# EAGLE schematic mod_io (EAGLE 7.5.0)
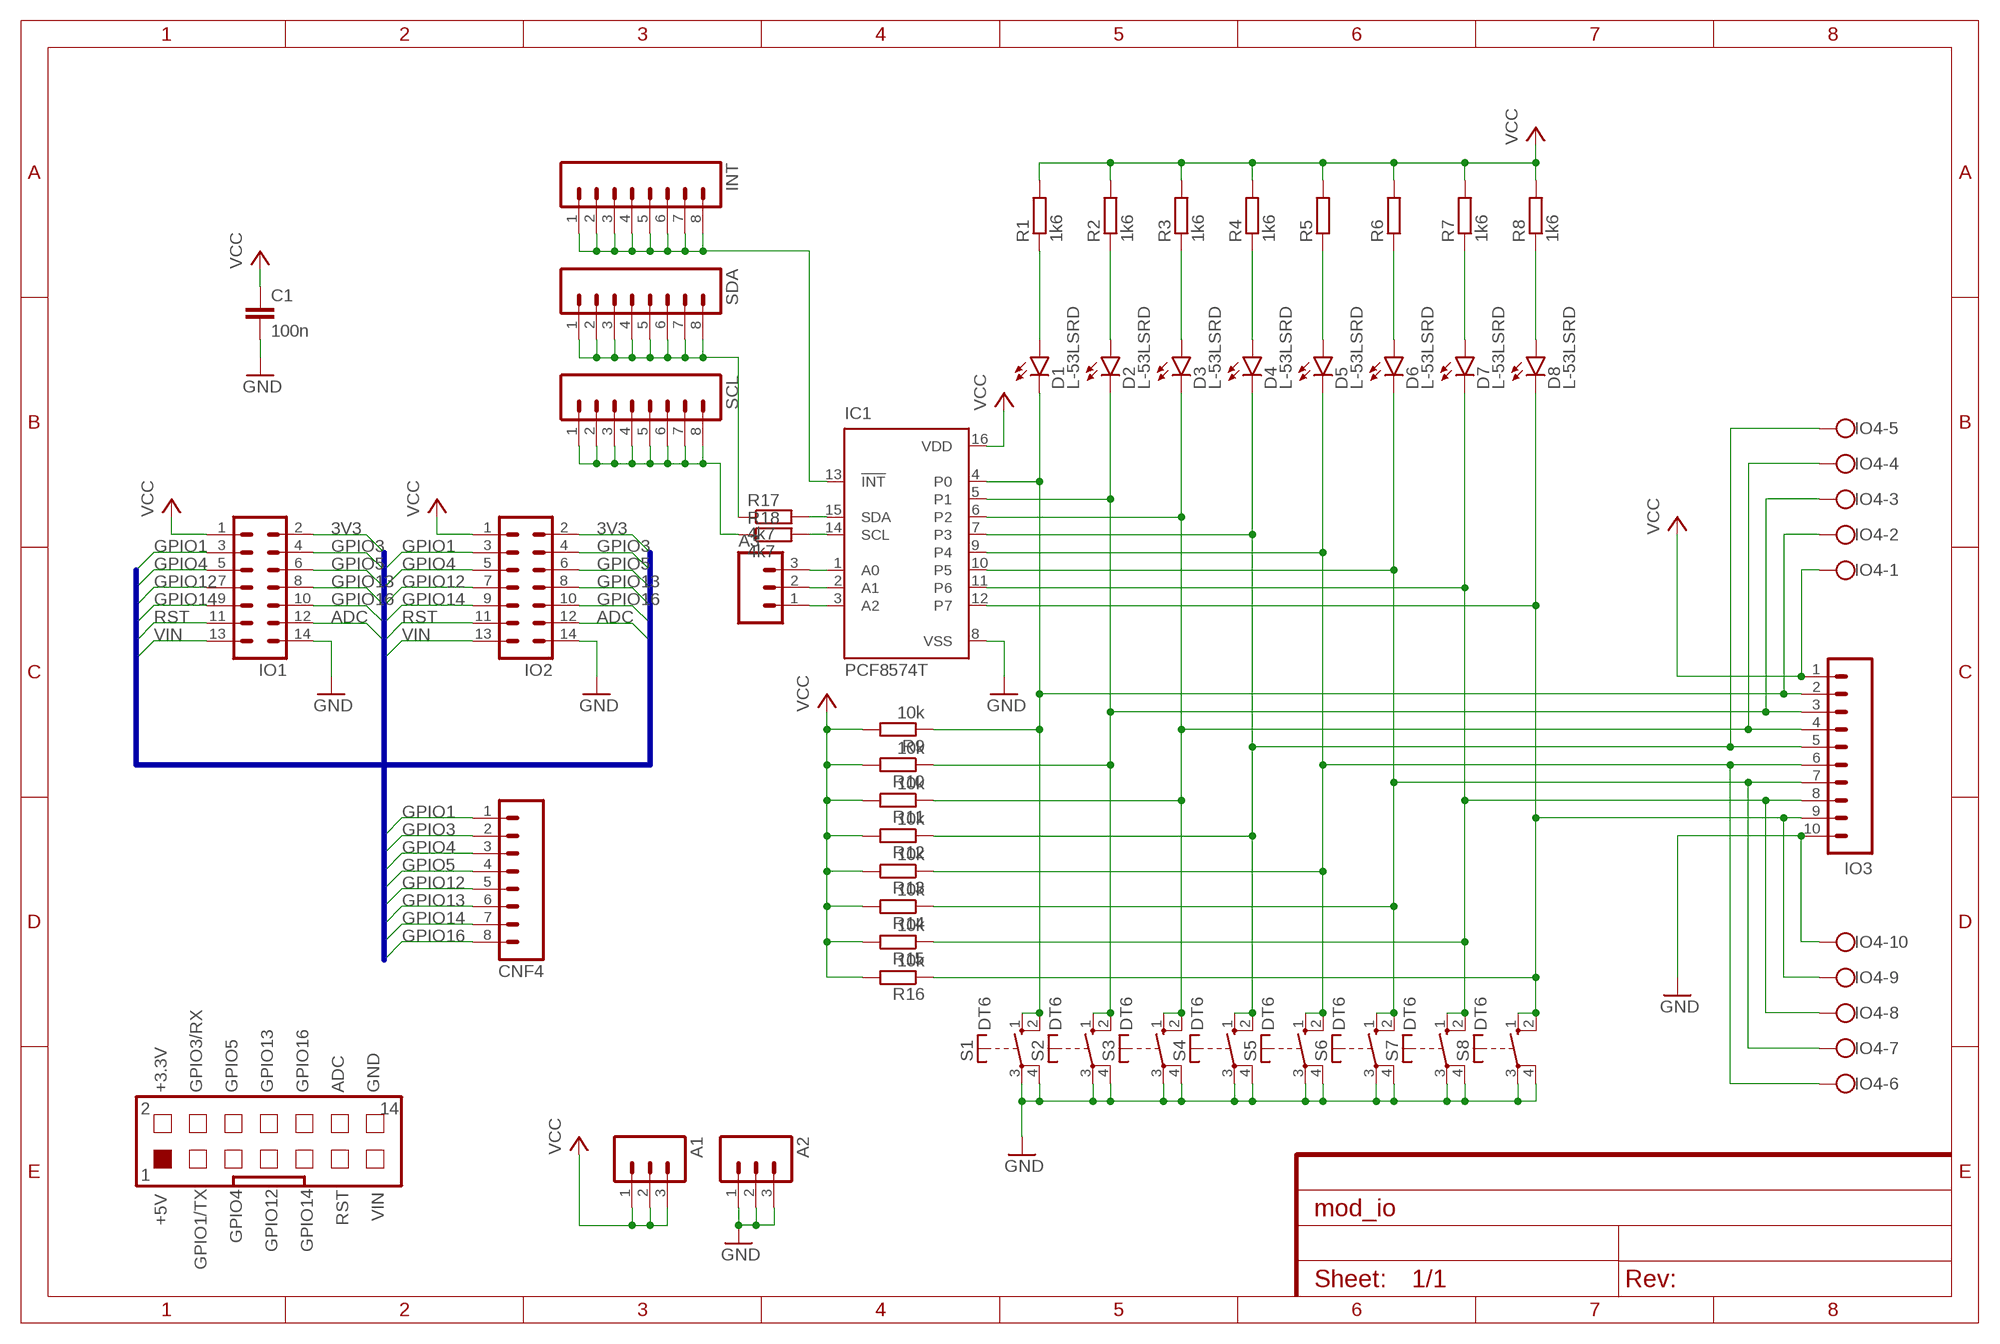
[diagram p0: schematic, sheet 1]
FRAME1 (FRAME-A4L): CNAME: I/O Expander for IoT Module; CREVISION: 1; DESIGNER: M.Vagovszky

## Parts
A1  M03LONGPADS  [1X03_LONGPADS]
A2  M03LONGPADS  [1X03_LONGPADS]
A3  M03LONGPADS  [1X03_LONGPADS]
C1  100n  C-EU050-025X075  [C050-025X075]
CNF4  M08LONGPADS  [1X08_LONGPADS]
D1  L-53LSRD  LED5MM  [LED5MM]
D2  L-53LSRD  LED5MM  [LED5MM]
D3  L-53LSRD  LED5MM  [LED5MM]
D4  L-53LSRD  LED5MM  [LED5MM]
D5  L-53LSRD  LED5MM  [LED5MM]
D6  L-53LSRD  LED5MM  [LED5MM]
D7  L-53LSRD  LED5MM  [LED5MM]
D8  L-53LSRD  LED5MM  [LED5MM]
IC1  PCF8574T  [SO16W]
INT  M08LONGPADS  [1X08_LONGPADS]
IO1  14V  [14V]
IO2  14V  [14V]
IO3  M10LOCK_LONGPADS  [1X10_LOCK_LONGPADS]
IO4  AK550/10  [AK550/10]
R1  1k6  R-EU_0207/10  [0207/10]
R2  1k6  R-EU_0207/10  [0207/10]
R3  1k6  R-EU_0207/10  [0207/10]
R4  1k6  R-EU_0207/10  [0207/10]
R5  R-EU_0207/10  [0207/10]
R6  R-EU_0207/10  [0207/10]
R7  1k6  R-EU_0207/10  [0207/10]
R8  1k6  R-EU_0207/10  [0207/10]
R9  10k  R-EU_0207/10  [0207/10]
R10  10k  R-EU_0207/10  [0207/10]
R11  10k  R-EU_0207/10  [0207/10]
R12  10k  R-EU_0207/10  [0207/10]
R13  10k  R-EU_0207/10  [0207/10]
R14  10k  R-EU_0207/10  [0207/10]
R15  10k  R-EU_0207/10  [0207/10]
R16  10k  R-EU_0207/10  [0207/10]
R17  4k7  R-EU_0207/10  [0207/10]
R18  4k7  R-EU_0207/10  [0207/10]
S1  DT6  [DT6]
S2  DT6  [DT6]
S3  DT6  [DT6]
S4  DT6  [DT6]
S5  DT6  [DT6]
S6  DT6  [DT6]
S7  DT6  [DT6]
S8  DT6  [DT6]
SCL  M08LONGPADS  [1X08_LONGPADS]
SDA  M08LONGPADS  [1X08_LONGPADS]

## Nets
3V3: IO1.2 IO2.2
ADC: IO1.12 IO2.12
GND: A2.1 A2.2 A2.3 C1.2 IC1.8(VSS) IO1.14 IO2.14 IO3.10 IO4.10 S1.3(P) S1.4(P) S2.3(P) S2.4(P) S3.3(P) S3.4(P) S4.3(P) S4.4(P) S5.3(P) S5.4(P) S6.3(P) S6.4(P) S7.3(P) S7.4(P) S8.3(P) S8.4(P)
GPIO1: CNF4.1 IO1.3 IO2.3
GPIO3: CNF4.2 IO1.4 IO2.4
GPIO4: CNF4.3 IO1.5 IO2.5
GPIO5: CNF4.4 IO1.6 IO2.6
GPIO12: CNF4.5 IO1.7 IO2.7
GPIO13: CNF4.6 IO1.8 IO2.8
GPIO14: CNF4.7 IO1.9 IO2.9
GPIO16: CNF4.8 IO1.10 IO2.10
N$1: D5.K(C) IC1.9(P4) IO3.6 IO4.6 R13.1 S5.1(S) S5.2(S)
N$2: D6.K(C) IC1.10(P5) IO3.7 IO4.7 R14.1 S6.1(S) S6.2(S)
N$3: D1.K(C) IC1.4(P0) IO3.2 IO4.2 R9.1 S1.1(S) S1.2(S)
N$4: D2.K(C) IC1.5(P1) IO3.3 IO4.3 R10.1 S2.1(S) S2.2(S)
N$5: D3.K(C) IC1.6(P2) IO3.4 IO4.4 R11.1 S3.1(S) S3.2(S)
N$6: D4.K(C) IC1.7(P3) IO3.5 IO4.5 R12.1 S4.1(S) S4.2(S)
N$7: D7.K(C) IC1.11(P6) IO3.8 IO4.8 R15.1 S7.1(S) S7.2(S)
N$8: D8.K(C) IC1.12(P7) IO3.9 IO4.9 R16.1 S8.1(S) S8.2(S)
N$9: D6.A R6.1
N$10: D5.A R5.1
N$11: D7.A R7.1
N$12: D8.A R8.1
N$13: D1.A R1.1
N$14: D2.A R2.1
N$15: D3.A R3.1
N$16: D4.A R4.1
N$17: IC1.13(!INT) INT.1 INT.2 INT.3 INT.4 INT.5 INT.6 INT.7 INT.8
N$18: A3.3 IC1.1(A0)
N$19: A3.2 IC1.2(A1)
N$20: A3.1 IC1.3(A2)
N$21: IC1.15(SDA) R17.2
N$22: IC1.14(SCL) R18.2
N$23: R17.1 SDA.1 SDA.2 SDA.3 SDA.4 SDA.5 SDA.6 SDA.7 SDA.8
N$25: R18.1 SCL.1 SCL.2 SCL.3 SCL.4 SCL.5 SCL.6 SCL.7 SCL.8
RST: IO1.11 IO2.11
VCC: A1.1 A1.2 A1.3 C1.1 IC1.16(VDD) IO1.1 IO2.1 IO3.1 IO4.1 R1.2 R2.2 R3.2 R4.2 R5.2 R6.2 R7.2 R8.2 R9.2 R10.2 R11.2 R12.2 R13.2 R14.2 R15.2 R16.2
VIN: IO1.13 IO2.13

## Buses
BUS:RST,ADC,GPIO16,GPIO[4..5],GPIO[12..14],GPIO1,GPIO3,VIN,3V3

## Notes on the sheet
- +3.3V | GPIO3/RX | GPIO5 | GPIO13 | GPIO16 | ADC | GND
- 2 | 14
- 1
- +5V | RST | VIN
- GPIO4
- GPIO12 | GPIO14
- GPIO1/TX

## Library data of the parts
A1-A3 = SparkFun-Connectors:M03: Header 3 Standard 3-pin 0.1" header. Use with straight break away headers (SKU : PRT-00116), right angle break away headers (PRT-00553), swiss pins (PRT-00743), machine pins (PRT-00117), and female headers (PRT-00115). Molex polarized connector foot print use with SKU : PRT-08232 with associated crimp pins and housings.
C1 = rcl:C-EU: CAPACITOR, European symbol
CNF4 INT SCL SDA = SparkFun-Connectors:M08: Header 8 Standard 8-pin 0.1" header. Use with straight break away headers (SKU : PRT-00116), right angle break away headers (PRT-00553), swiss pins (PRT-00743), machine pins (PRT-00117), and female headers (PRT-00115).
D1-D8 = SparkFun-LED:LED: LEDs Standard schematic elements and footprints for 5mm, 3mm, 1206, and 0603 sized LEDs. 5mm - Spark Fun Electronics SKU : COM-00529 (and others)
IC1 = micro-philips:PCF8574: I2C-Bus Remote 8-bit I/O expander http://www.semiconductors.philips.com/acrobat_download/datasheets/PCF8574_4.pdf; MPN: PCF8574T/3,512; OC_FARNELL: 1201255; OC_NEWARK: 70R6870
IO1 IO2 = con-harting-v:14V: CONNECTOR; OC_FARNELL: unknown; OC_NEWARK: unknown
IO3 = SparkFun-Connectors:M10: Header 10 Standard 10-pin 0.1" header. Use with straight break away headers (SKU : PRT-00116), right angle break away headers (PRT-00553), swiss pins (PRT-00743), machine pins (PRT-00117), and female headers (PRT-00115).
IO4 = con-ptr500+:AK550/10: CONNECTOR
R1-R18 = resistor:R-EU_: RESISTOR, European symbol
S1-S8 = switch-misc:DT: ITT SWITCH